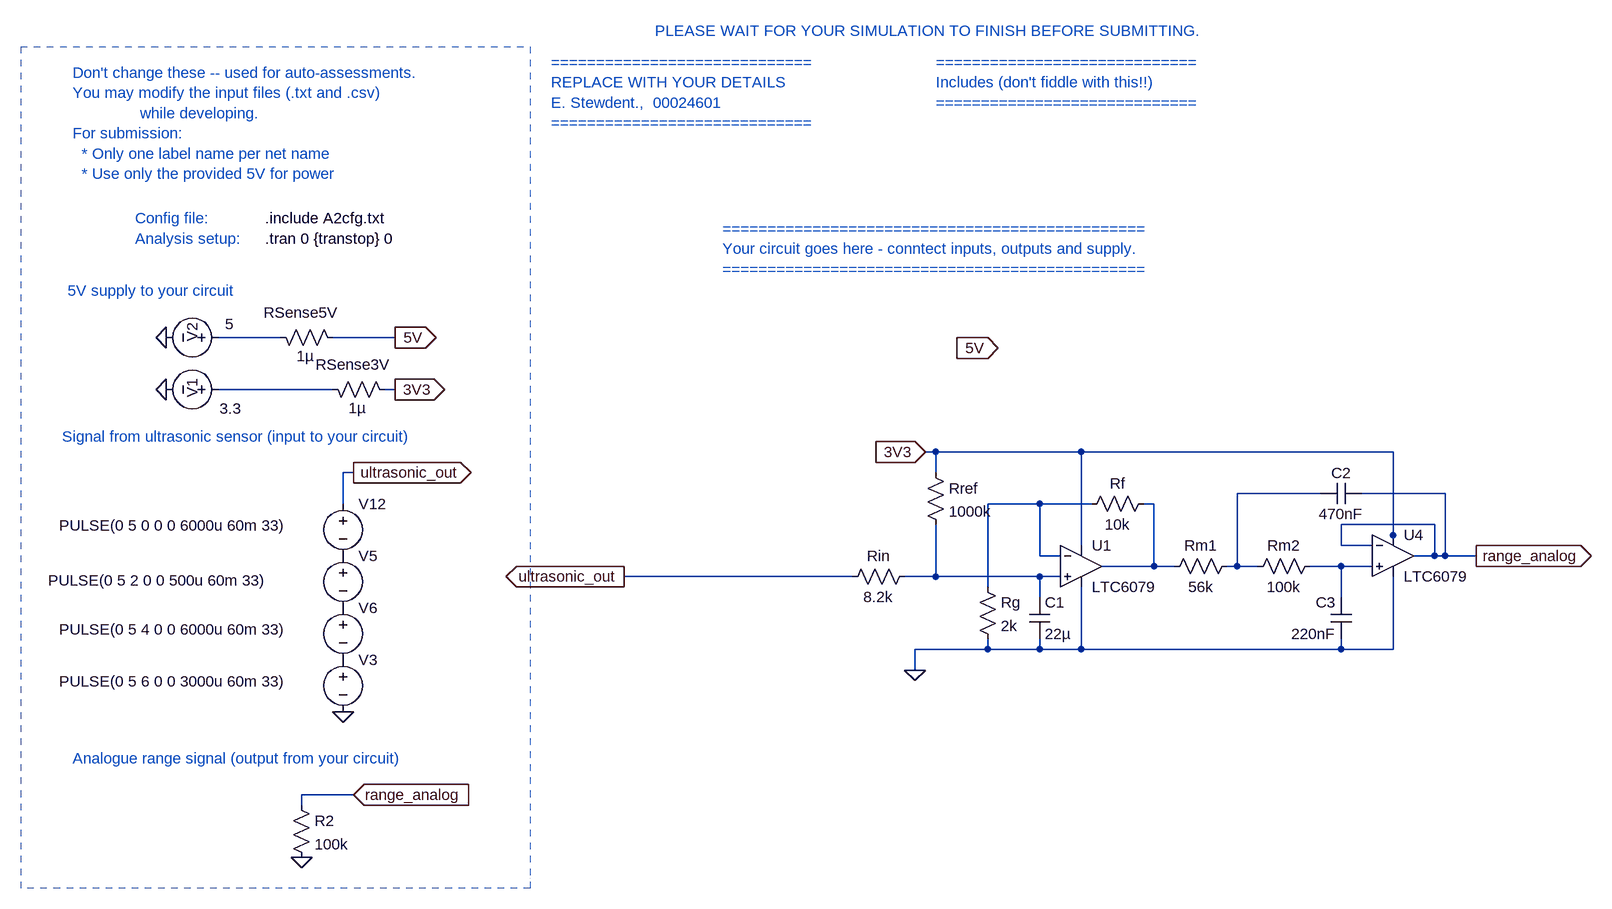
[diagram p0: schematic E344_Ass2_239050932A.asc]
E344_Ass2_239050932A.asc, the LTspice schematic file:
Version 4
SHEET 1 3140 2124
WIRE -1968 -976 -2064 -976
WIRE -1792 -976 -1888 -976
WIRE -1888 -896 -2064 -896
WIRE -1792 -896 -1808 -896
WIRE -960 -800 -976 -800
WIRE -736 -800 -960 -800
WIRE -256 -800 -736 -800
WIRE -1856 -768 -1872 -768
WIRE -960 -768 -960 -800
WIRE -368 -736 -496 -736
WIRE -176 -736 -304 -736
WIRE -1872 -720 -1872 -768
WIRE -800 -720 -880 -720
WIRE -720 -720 -800 -720
WIRE -624 -720 -640 -720
WIRE -192 -688 -336 -688
WIRE -256 -672 -256 -800
WIRE -736 -656 -736 -800
WIRE -336 -656 -336 -688
WIRE -288 -656 -336 -656
WIRE -256 -656 -256 -672
WIRE -800 -640 -800 -720
WIRE -768 -640 -800 -640
WIRE -192 -640 -192 -688
WIRE -192 -640 -224 -640
WIRE -176 -640 -176 -736
WIRE -176 -640 -192 -640
WIRE -128 -640 -176 -640
WIRE -624 -624 -624 -720
WIRE -624 -624 -704 -624
WIRE -592 -624 -624 -624
WIRE -496 -624 -496 -736
WIRE -496 -624 -512 -624
WIRE -464 -624 -496 -624
WIRE -336 -624 -384 -624
WIRE -288 -624 -336 -624
WIRE -1088 -608 -1440 -608
WIRE -960 -608 -960 -688
WIRE -960 -608 -1008 -608
WIRE -800 -608 -960 -608
WIRE -768 -608 -800 -608
WIRE -880 -592 -880 -720
WIRE -800 -576 -800 -608
WIRE -336 -576 -336 -624
WIRE -880 -496 -880 -512
WIRE -880 -496 -992 -496
WIRE -800 -496 -800 -512
WIRE -800 -496 -880 -496
WIRE -736 -496 -736 -592
WIRE -736 -496 -800 -496
WIRE -336 -496 -336 -512
WIRE -336 -496 -736 -496
WIRE -256 -496 -256 -608
WIRE -256 -496 -336 -496
WIRE -992 -464 -992 -496
WIRE -1856 -272 -1936 -272
WIRE -1936 -256 -1936 -272
FLAG -1792 -976 5V
IOPIN -1792 -976 Out
FLAG -2144 -976 0
FLAG -864 -960 5V
IOPIN -864 -960 In
FLAG -1872 -400 0
FLAG -1856 -768 ultrasonic_out
IOPIN -1856 -768 Out
FLAG -1440 -608 ultrasonic_out
IOPIN -1440 -608 Out
FLAG -128 -640 range_analog
IOPIN -128 -640 Out
FLAG -1856 -272 range_analog
IOPIN -1856 -272 In
FLAG -1936 -176 0
FLAG -1792 -896 3V3
IOPIN -1792 -896 Out
FLAG -2144 -896 0
FLAG -976 -800 3V3
IOPIN -976 -800 In
FLAG -992 -464 0
SYMBOL voltage -2048 -976 R90
WINDOW 123 0 0 Left 0
WINDOW 39 0 0 Left 0
WINDOW 0 -23 56 Left 2
WINDOW 3 -21 -8 VRight 2
SYMATTR InstName V2
SYMATTR Value 5
SYMBOL res -1984 -992 M90
WINDOW 0 -7 47 VBottom 2
WINDOW 3 29 54 VTop 2
SYMATTR InstName RSense5V
SYMATTR Value 1µ
SYMBOL Opamps\\LTC6079 -256 -640 R0
SYMATTR InstName U4
SYMBOL voltage -1872 -736 R0
WINDOW 123 0 0 Left 0
WINDOW 39 0 0 Left 0
WINDOW 3 -437 49 Left 2
SYMATTR Value PULSE(0 5 0 0 0 6000u 60m 33)
SYMATTR InstName V12
SYMBOL voltage -1872 -656 R0
WINDOW 123 0 0 Left 0
WINDOW 39 0 0 Left 0
WINDOW 3 -454 54 Left 2
SYMATTR Value PULSE(0 5 2 0 0 500u 60m 33)
SYMATTR InstName V5
SYMBOL voltage -1872 -576 R0
WINDOW 123 0 0 Left 0
WINDOW 39 0 0 Left 0
WINDOW 3 -437 49 Left 2
SYMATTR Value PULSE(0 5 4 0 0 6000u 60m 33)
SYMATTR InstName V6
SYMBOL voltage -1872 -496 R0
WINDOW 123 0 0 Left 0
WINDOW 39 0 0 Left 0
WINDOW 3 -437 49 Left 2
SYMATTR Value PULSE(0 5 6 0 0 3000u 60m 33)
SYMATTR InstName V3
SYMBOL res -1952 -272 R0
SYMATTR InstName R2
SYMATTR Value 100k
SYMBOL voltage -2048 -896 R90
WINDOW 123 0 0 Left 0
WINDOW 39 0 0 Left 0
WINDOW 0 -17 56 Left 2
WINDOW 3 29 -20 VRight 2
SYMATTR InstName V1
SYMATTR Value 3.3
SYMBOL res -1904 -912 M90
WINDOW 0 -7 47 VBottom 2
WINDOW 3 29 54 VTop 2
SYMATTR InstName RSense3V
SYMATTR Value 1µ
SYMBOL Opamps\\LTC6079 -736 -624 R0
SYMATTR InstName U1
SYMBOL res -496 -640 R90
WINDOW 0 0 56 VBottom 2
WINDOW 3 32 56 VTop 2
SYMATTR InstName Rm1
SYMATTR Value 56k
SYMBOL res -368 -640 R90
WINDOW 0 0 56 VBottom 2
WINDOW 3 32 56 VTop 2
SYMATTR InstName Rm2
SYMATTR Value 100k
SYMBOL cap -320 -512 R180
WINDOW 0 24 56 Left 2
WINDOW 3 24 8 Left 2
SYMATTR InstName C3
SYMATTR Value 220nF
SYMBOL cap -304 -752 R90
WINDOW 0 0 32 VBottom 2
WINDOW 3 32 32 VTop 2
SYMATTR InstName C2
SYMATTR Value 470nF
SYMBOL res -992 -624 R90
WINDOW 0 0 56 VBottom 2
WINDOW 3 32 56 VTop 2
SYMATTR InstName Rin
SYMATTR Value 8.2k
SYMBOL cap -816 -576 R0
SYMATTR InstName C1
SYMATTR Value 22µ
SYMBOL res -624 -736 R90
WINDOW 0 0 56 VBottom 2
WINDOW 3 32 56 VTop 2
SYMATTR InstName Rf
SYMATTR Value 10k
SYMBOL res -896 -608 R0
SYMATTR InstName Rg
SYMATTR Value 2k
SYMBOL res -976 -784 R0
SYMATTR InstName Rref
SYMATTR Value 1000k
TEXT -1992 -1128 Left 2 !.tran 0 {transtop} 0
TEXT -1992 -1160 Left 2 !.include A2cfg.txt
TEXT -2288 -1384 Left 2 ;Don't change these -- used for auto-assessments.\nYou may modify the input files (.txt and .csv) \n               while developing.\nFor submission: \n  * Only one label name per net name\n  * Use only the provided 5V for power
TEXT -2192 -1160 Left 2 ;Config file:
TEXT -2192 -1128 Left 2 ;Analysis setup:
TEXT -1552 -1400 Left 2 ;=============================\nREPLACE WITH YOUR DETAILS\nE. Stewdent.,  00024601\n=============================
TEXT -960 -1400 Left 2 ;=============================\nIncludes (don't fiddle with this!!)\n=============================
TEXT -1288 -1144 Left 2 ;===============================================\nYour circuit goes here - conntect inputs, outputs and supply.\n===============================================
TEXT -1392 -1448 Left 2 ;PLEASE WAIT FOR YOUR SIMULATION TO FINISH BEFORE SUBMITTING.
TEXT -2304 -824 Left 2 ;Signal from ultrasonic sensor (input to your circuit)
TEXT -2296 -1048 Left 2 ;5V supply to your circuit
TEXT -2288 -328 Left 2 ;Analogue range signal (output from your circuit)
LINE Normal -1584 -1424 -1584 -128 2
LINE Normal -2368 -1424 -1584 -1424 2
LINE Normal -1584 -128 -2368 -128 2
LINE Normal -1584 -144 -1584 -144 2
LINE Normal -2368 -1424 -2368 -128 2

The netlist it stands for:
* E344_Ass2_239050932A.asc
V2 N001 0 5
RSense5V N001 5V 1µ
XU4 N006 range_analog 3V3 0 range_analog LTC6078  ; LTC6079, pins In+ In- V+ V- OUT
V12 ultrasonic_out P001 PULSE(0 5 0 0 0 6000u 60m 33)
V5 P001 P002 PULSE(0 5 2 0 0 500u 60m 33)
V6 P002 P003 PULSE(0 5 4 0 0 6000u 60m 33)
V3 P003 0 PULSE(0 5 6 0 0 3000u 60m 33)
R2 range_analog 0 100k
V1 N002 0 3.3
RSense3V N002 3V3 1µ
XU1 N007 N004 3V3 0 N005 LTC6078  ; LTC6079, pins In+ In- V+ V- OUT
Rm1 N003 N005 56k
Rm2 N006 N003 100k
C3 0 N006 220nF
C2 range_analog N003 470nF
Rin N007 ultrasonic_out 8.2k
C1 N007 0 22µ
Rf N005 N004 10k
Rg N004 0 2k
Rref 3V3 N007 1000k
.tran 0 {transtop} 0
.include A2cfg.txt
* Don't change these -- used for auto-assessments.
* You may modify the input files (.txt and .csv)
*                while developing.
* For submission:
*   * Only one label name per net name
*   * Use only the provided 5V for power
* Config file:
* Analysis setup:
* =============================
* REPLACE WITH YOUR DETAILS
* E. Stewdent.,  00024601
* =============================
* =============================
* Includes (don't fiddle with this!!)
* =============================
* ===============================================
* Your circuit goes here - conntect inputs, outputs and supply.
* ===============================================
* PLEASE WAIT FOR YOUR SIMULATION TO FINISH BEFORE SUBMITTING.
* Signal from ultrasonic sensor (input to your circuit)
* 5V supply to your circuit
* Analogue range signal (output from your circuit)
.lib LTC5.lib
.backanno
.end